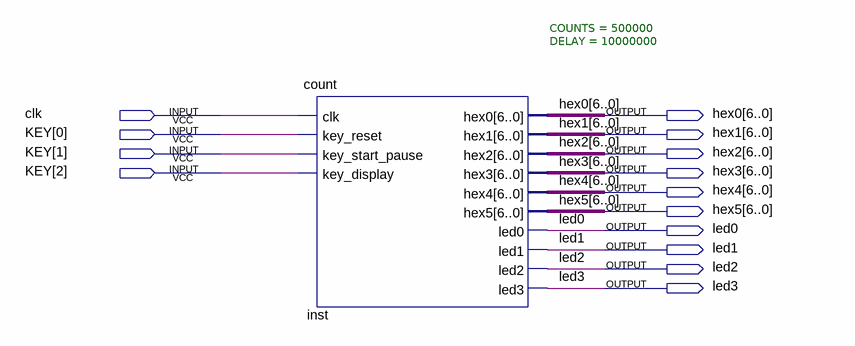
[diagram p0: schematic sheet]
// Quartus schematic stopwatch.bdf as structural Verilog: 1 symbols, 14 pins
module stopwatch (
  input  clk,
  input  [2:0] KEY,
  output [6:0] hex0,
  output [6:0] hex1,
  output [6:0] hex2,
  output [6:0] hex3,
  output [6:0] hex4,
  output [6:0] hex5,
  output led0,
  output led1,
  output led2,
  output led3
);

  count #(.COUNTS(500000), .DELAY(10000000)) inst (
    .clk(clk), .key_reset(KEY[0]), .key_start_pause(KEY[1]), .key_display(KEY[2]), .hex0(hex0), .hex1(hex1),
    .hex2(hex2), .hex3(hex3), .hex4(hex4), .hex5(hex5), .led0(led0), .led1(led1), .led2(led2), .led3(led3));
endmodule
